# EasyEDA Pro project 空调控制板.epro

# Schematic 空调控制板
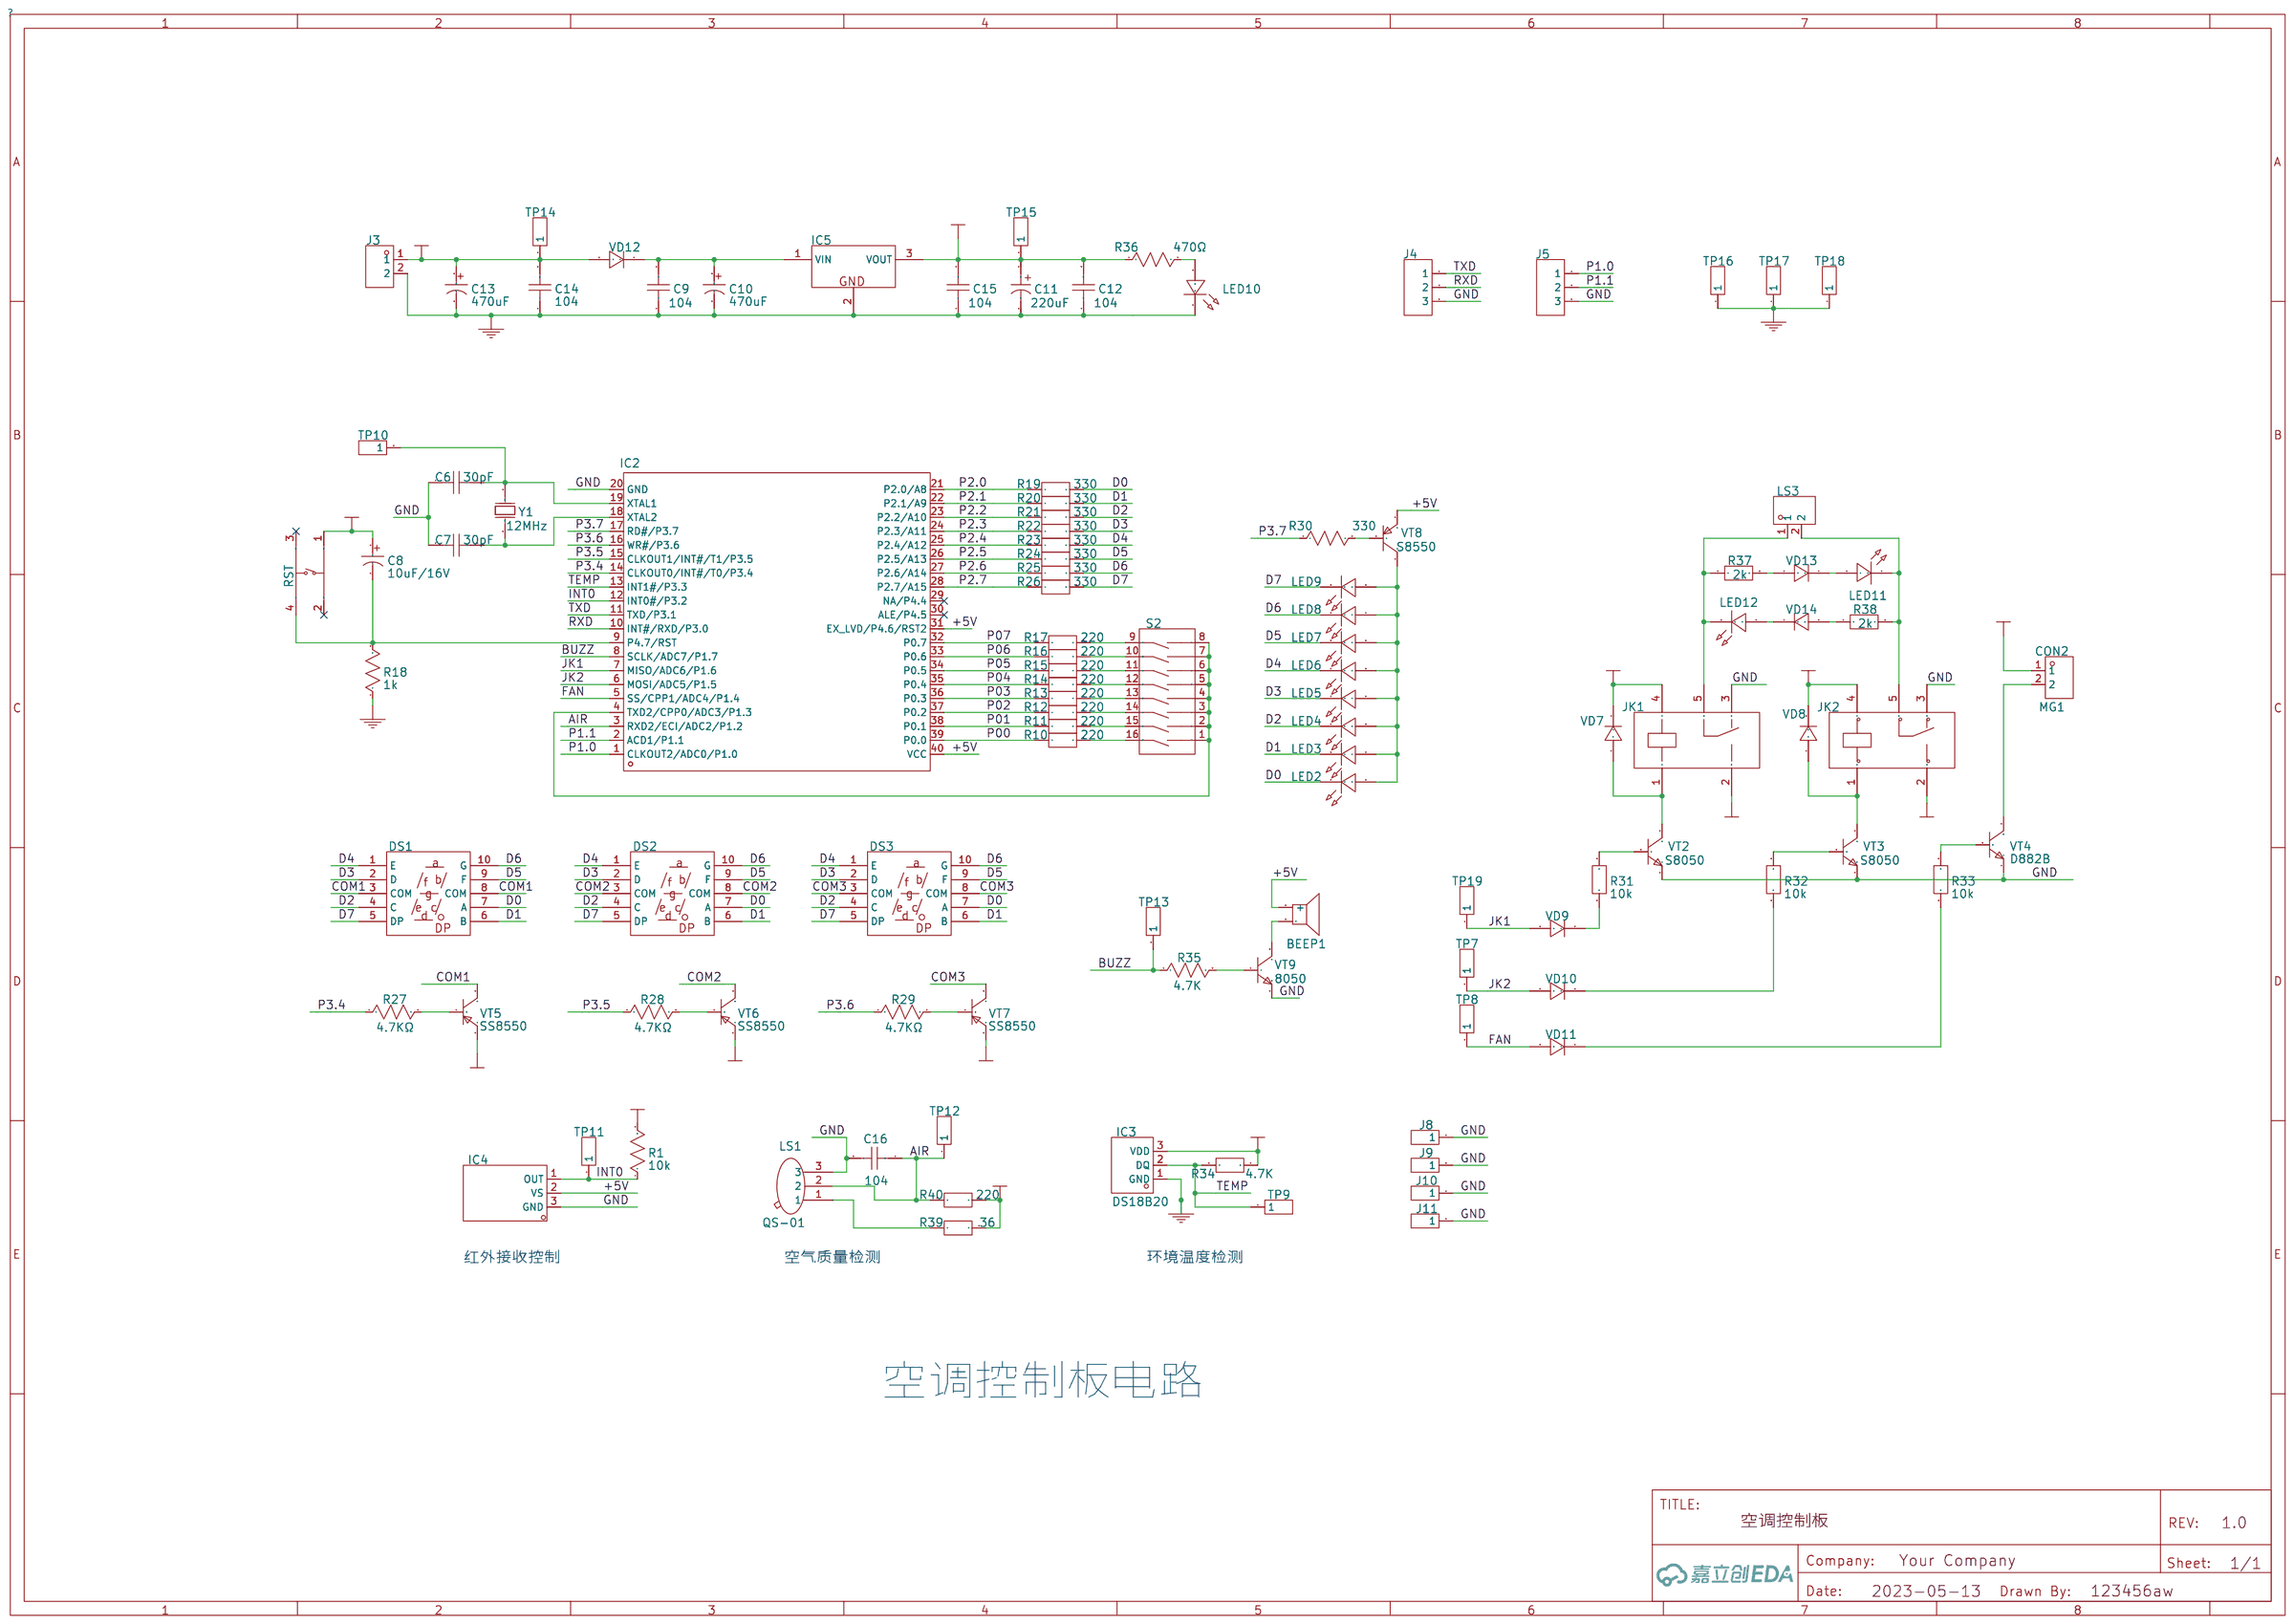
[diagram p0: schematic sheet]

## Parts
BEEP1  TMB12A05  [BUZ-TH_BD12.0-P7.60-D0.6-FD]
C6  30pF  [C0805]
C7  30pF  [C0805]
C8  10uF/16V  [CAP-TH_BD5.0-P2.5-D0.5-FD]
C9  104  [C0805]
C10  470uF  [CAP-TH_BD10.0-P5.00-D1.0-FD]
C11  220uF  [CAP-TH_BD8.0-P3.50-D0.6-FD_1]
C12  104  [C0805]
C13  470uF  [CAP-TH_BD10.0-P5.00-D1.0-FD]
C14  104  [C0805]
C15  104  [C0805]
C16  104  [C0805]
CON2  MG1  [CONN-TH_XY301V-A-5.0-2P]
DS1  FJ5101BH  [LED-SEG-TH_FJ5101BH]
DS2  FJ5101BH  [LED-SEG-TH_FJ5101BH]
DS3  FJ5101BH  [LED-SEG-TH_FJ5101BH]
IC2  STC12C5A32S2  [DIP-40_L52.3-W13.9-P2.54-LS15.2-BL]
IC3  DS18B20  [TO-92-3_L4.9-W3.7-P1.27-L]
IC4  TSOP31256  [红外接收管封装]
IC5  LM7805CT_C5444281  [三端稳压器LM7805]
J3  GND   +12V  [CONN-TH_XY301V-A-5.0-2P]
J4  TXD RXD GND  [HDR-F-2.54_1X3]
J5  HDR-F-2.54_1x3  [HDR-F-2.54_1X3]
J8  RS  [焊盘M3]
J9  RS  [焊盘M3]
J10  RS  [焊盘M3]
J11  RS  [焊盘M3]
JK1  SRD-12VDC-SL-C  [RELAY-TH_SRD-XXVDC-XL-C]
JK2  SRD-12VDC-SL-C  [RELAY-TH_SRD-XXVDC-XL-C]
LED2  LED-0805_R  [LED0805_RED]
LED3  LED-0805_R  [LED0805_RED]
LED4  LED-0805_R  [LED0805_RED]
LED5  LED-0805_R  [LED0805_RED]
LED6  LED-0805_R  [LED0805_RED]
LED7  LED-0805_R  [LED0805_RED]
LED8  LED-0805_R  [LED0805_RED]
LED9  LED-0805_R  [LED0805_RED]
LED10  LED-0805_R  [LED0805_RED]
LED11  LED-0805_R  [LED0805_RED]
LED12  LED-0805_R  [LED0805_RED]
LS1  QS-01  [空气质量传感器]
LS3  XY301V-A-5.0-2P  [CONN-TH_XY301V-A-5.0-2P]
R1  10k  [R0805]
R10  220  [R0805]
R11  220  [R0805]
R12  220  [R0805]
R13  220  [R0805]
R14  220  [R0805]
R15  220  [R0805]
R16  220  [R0805]
R17  220  [R0805]
R18  1k  [R0805]
R19  330  [R0805]
R20  330  [R0805]
R21  330  [R0805]
R22  330  [R0805]
R23  330  [R0805]
R24  330  [R0805]
R25  330  [R0805]
R26  330  [R0805]
R27  4.7KΩ  [R0805]
R28  4.7KΩ  [R0805]
R29  4.7KΩ  [R0805]
R30  330  [R0805]
R31  10k  [R0805]
R32  10k  [R0805]
R33  10k  [R0805]
R34  4.7K  [R0805]
R35  4.7K  [R0805]
R36  470Ω  [R0805]
R37  2k  [R0805]
R38  2k  [R0805]
R39  36  [R2010]
R40  220  [R0805]
RST  TS665CJ  [SW-TH_4P-L6.0-W6.0-P4.50-LS6.5]
S2  2.54插件8位拨码开关  [SW-TH_16P-L21.9-W9.9-P2.54-LS7.8]
TP7  HDR-M-2.54_1x1  [HDR-M-2.54_1X1]
TP8  HDR-M-2.54_1x1  [HDR-M-2.54_1X1]
TP9  HDR-M-2.54_1x1  [HDR-M-2.54_1X1]
TP10  HDR-M-2.54_1x1  [HDR-M-2.54_1X1]
TP11  HDR-M-2.54_1x1  [HDR-M-2.54_1X1]
TP12  HDR-M-2.54_1x1  [HDR-M-2.54_1X1]
TP13  HDR-M-2.54_1x1  [HDR-M-2.54_1X1]
TP14  HDR-M-2.54_1x1  [HDR-M-2.54_1X1]
TP15  HDR-M-2.54_1x1  [HDR-M-2.54_1X1]
TP16  HDR-M-2.54_1x1  [HDR-M-2.54_1X1]
TP17  HDR-M-2.54_1x1  [HDR-M-2.54_1X1]
TP18  HDR-M-2.54_1x1  [HDR-M-2.54_1X1]
TP19  HDR-M-2.54_1x1  [HDR-M-2.54_1X1]
VD7  1N4007G_C189227  [DO-41_BD2.4-L4.7-P8.70-D0.9-RD]
VD8  1N4007G_C189227  [DO-41_BD2.4-L4.7-P8.70-D0.9-RD]
VD9  1N4007G_C189227  [DO-41_BD2.4-L4.7-P8.70-D0.9-RD]
VD10  1N4007G_C189227  [DO-41_BD2.4-L4.7-P8.70-D0.9-RD]
VD11  1N4007G_C189227  [DO-41_BD2.4-L4.7-P8.70-D0.9-RD]
VD12  1N4007G_C189227  [DO-41_BD2.4-L4.7-P8.70-D0.9-RD]
VD13  1N4007G_C189227  [DO-41_BD2.4-L4.7-P8.70-D0.9-RD]
VD14  1N4007G_C189227  [DO-41_BD2.4-L4.7-P8.70-D0.9-RD]
VT2  S8050  [SOT-23-3_L2.9-W1.6-P1.90-LS2.8-BR]
VT3  S8050  [SOT-23-3_L2.9-W1.6-P1.90-LS2.8-BR]
VT4  D882B  [TO-126_L7.8-W2.7-P2.30-L]
VT5  SS8550  [SOT-23-3_L2.9-W1.3-P1.90-LS2.4-BR]
VT6  SS8550  [SOT-23-3_L2.9-W1.3-P1.90-LS2.4-BR]
VT7  SS8550  [SOT-23-3_L2.9-W1.3-P1.90-LS2.4-BR]
VT8  S8550  [SOT-23-3_L2.9-W1.6-P1.90-LS2.8-BR]
VT9  8050  [SOT-23-3_L2.9-W1.6-P1.90-LS2.8-BR]
Y1  12MHz  [HC-49US_L11.5-W4.5-P4.88]

## Library data of the parts
BEEP1 = TMB12A05: link: https://item.szlcsc.com/200842.html; 3DModel: BUZ-TH_D12.0-H9.5-P7.60; Supplier: LCSC; Manufacturer: 华能; Supplier Part: C96093; JLCPCB Part Class: Extended Part; Frequency: 2.3kHz
C6 C7 = 30pF: link: https://item.szlcsc.com/373011.html; 3DModel: C0805_L2.0-W1.3-H1.3
C8 = 10uF/16V: link: https://item.szlcsc.com/292492.html; 3DModel: CAP-TH_BD5.0-H7.5-P2.5; Supplier: LCSC; Supplier Part: C216288; Manufacturer: HUAWEI(华威集团); Manufacturer Part: RL1C100MC110A00CV0; JLCPCB Part Class: Extended Part
C9 C12 C14-C16 = 104: link: https://item.szlcsc.com/373011.html; 3DModel: C0805_L2.0-W1.3-H1.3
C10 C13 = 470uF: link: https://item.szlcsc.com/44833.html; 3DModel: CAP-TH_D10.0-H16.0-P5.00; Supplier: LCSC; Manufacturer: CX(承兴); Manufacturer Part: KM477M050G20RR0VH2FP0; Supplier Part: C34642; JLCPCB Part Class: Extended Part
C11 = 220uF: link: https://atta.szlcsc.com/upload/public/pdf/source/20180416/C191234_733C5C0149568155CE2C084CF497C985.pdf; Supplier: LCSC; Supplier Part: C9900021408; Manufacturer: null; Manufacturer Part: 220uF/35V; JLCPCB Part Class: Extended Part
CON2 = MG1: link: https://item.szlcsc.com/581014.html; Supplier: LCSC; Supplier Part: C557651; Manufacturer: XINLAIYA(新莱亚); Manufacturer Part: XY301V-A-5.0-2P; JLCPCB Part Class: Extended Part
DS1-DS3 = FJ5101BH: link: https://item.szlcsc.com/24195.html; 3DModel: LED-SEG-TH_10P-L12.6-W19.0-H8.0-P2.54-S15.24; Supplier: LCSC; Manufacturer: 志浩; Supplier Part: C23462; JLCPCB Part Class: Extended Part
IC2 = STC12C5A32S2: link: https://lcsc.com/product-detail/Others_STC11F56XE-35I-DIP40_C190522.html; Supplier Part: C66940; Supplier: LCSC; 3DModel: DIP-40_L52.3-W13.8-H4.0-LS15.24-P2.54; Manufacturer: STC(宏晶); Manufacturer Part: STC12C5A32S2-35I-PDIP40; JLCPCB Part Class: Extended Part
IC3 = DS18B20: link: https://atta.szlcsc.com/upload/public/pdf/source/20180629/C233232_99576441F8ED8E9074FB1575A6BE3592.PDF; Supplier: LCSC; Supplier Part: C376006; Manufacturer: UMW(广东友台半导体); JLCPCB Part Class: Extended Part
IC4 = TSOP31256: Supplier: LCSC; Supplier Part: C222500; Manufacturer: VISHAY(威世); JLCPCB Part Class: Extended Part
IC5 = LM7805CT_C5444281: link: https://atta.szlcsc.com/upload/public/pdf/source/20230412/F9CA8B8719EFD180D2AD5626231BCBB0.pdf; Supplier: LCSC; Supplier Part: C5444281; Manufacturer: Siproin(上海矽朋); Manufacturer Part: LM7805CT
J3 = GND   +12V: link: https://item.szlcsc.com/581014.html; Supplier: LCSC; Supplier Part: C557651; Manufacturer: XINLAIYA(新莱亚); Manufacturer Part: XY301V-A-5.0-2P; JLCPCB Part Class: Extended Part
J4 = TXD RXD GND: 3DModel: HDR-F-2.54_1x3; link: https://www.cjt.com/Upload/A2541.pdf; Supplier Part: C146690; Supplier: LCSC
J5 = HDR-F-2.54_1x3: link: https://www.cjt.com/Upload/A2541.pdf; Supplier Part: C146690; Supplier: LCSC
J8-J11 = RS: Supplier Part: C81276; Supplier: LCSC
JK1 JK2 = SRD-12VDC-SL-C: link: https://item.szlcsc.com/31188.html; 3DModel: RELAY-TH_L19.2-W15.6-H15.8; Supplier: LCSC; Manufacturer: 松乐; Supplier Part: C30431; JLCPCB Part Class: Extended Part
LED2-LED12 = LED-0805_R: 3DModel: LED0805_Red; Manufacturer: EVERLIGHT(台湾亿光); Manufacturer Part: 17-21SURC/S530-A3/TR8; Supplier Part: C72037
LS1 = QS-01: Supplier: LCSC; Supplier Part: C242507; Manufacturer: Winsen(炜盛); Manufacturer Part: MP901; JLCPCB Part Class: Extended Part
LS3 = XY301V-A-5.0-2P: link: https://item.szlcsc.com/581014.html; Supplier: LCSC; Supplier Part: C557651; Manufacturer: XINLAIYA(新莱亚); JLCPCB Part Class: Extended Part
R1 R31-R33 = 10k: link: https://item.szlcsc.com/142685.html; 3DModel: R0805_L2.0-W1.3-H0.6
R10-R17 R40 = 220: link: https://item.szlcsc.com/142685.html; 3DModel: R0805_L2.0-W1.3-H0.6
R18 = 1k: link: https://item.szlcsc.com/142685.html; 3DModel: R0805_L2.0-W1.3-H0.6
R19-R26 R30 = 330: link: https://item.szlcsc.com/142685.html; 3DModel: R0805_L2.0-W1.3-H0.6
R27-R29 = 4.7KΩ: link: https://item.szlcsc.com/142685.html; 3DModel: R0805_L2.0-W1.3-H0.6
R34 R35 = 4.7K: link: https://item.szlcsc.com/142685.html; 3DModel: R0805_L2.0-W1.3-H0.6
R36 = 470Ω: link: https://item.szlcsc.com/142685.html; 3DModel: R0805_L2.0-W1.3-H0.6
R37 R38 = 2k: link: https://item.szlcsc.com/142685.html; 3DModel: R0805_L2.0-W1.3-H0.6
R39 = 36: link: https://item.szlcsc.com/312125.html; 3DModel: R2010_L5.0-W2.5-H0.6; Supplier: LCSC; Supplier Part: C407043; Manufacturer: UNI-ROYAL(厚声); Manufacturer Part: 201007F360JT4E; JLCPCB Part Class: Extended Part
RST = TS665CJ: link: https://item.szlcsc.com/14483.html; 3DModel: SW-TH_4P-L6.0-W6.0-H5.0-LS6.5-P4.50; Supplier: LCSC; Supplier Part: C393938; Manufacturer: SHOU HAN(首韩); JLCPCB Part Class: Extended Part
S2 = 2.54插件8位拨码开关: link: https://img.jlc.com/image//data/smt-stock-produce/componentSizePhoto/2022-01-10/20de4d79767c4f13a7ca3c4356335101/BG2201070020_D21122300030_font.png; Supplier: LCSC; Supplier Part: C9900005795; Manufacturer: null; JLCPCB Part Class: Extended Part
TP7-TP19 = HDR-M-2.54_1x1: Supplier Part: C81276; Supplier: LCSC
VD7-VD14 = 1N4007G_C189227: link: https://item.szlcsc.com/85412.html; 3DModel: DO-41_D2.4-L4.7-P8.70; Supplier: LCSC; Supplier Part: C189227; Manufacturer: 迪一; Manufacturer Part: 1N4007G; JLCPCB Part Class: Extended Part
VT2 VT3 = S8050: link: https://item.szlcsc.com/14454.html; 3DModel: SOT-23-3L_L2.9-W1.6-H1.1-LS2.8-P0.95; Supplier: LCSC; Manufacturer: Hottech(合科泰); Supplier Part: C181158; JLCPCB Part Class: Extended Part
VT4 = D882B: link: https://item.szlcsc.com/156484.html; Supplier: LCSC; Supplier Part: C438615; Manufacturer: FeiHong(飞虹); JLCPCB Part Class: Extended Part
VT5-VT7 = SS8550: link: https://atta.szlcsc.comnull; 3DModel: SOT-23-3P_L2.9-W1.3-H1.0-LS2.4-P0.95; Supplier: LCSC; Supplier Part: C5120747; Manufacturer: MSKSEMI(美森科); Manufacturer Part: SS8550-MS; JLCPCB Part Class: Extended Part
VT8 = S8550: link: https://item.szlcsc.com/14454.html; 3DModel: SOT-23-3L_L2.9-W1.6-H1.1-LS2.8-P0.95; Supplier: LCSC; Manufacturer: CJ(江苏长电/长晶); Supplier Part: C105432; JLCPCB Part Class: Basic Part
VT9 = 8050: link: https://item.szlcsc.com/14454.html; 3DModel: SOT-23-3L_L2.9-W1.6-H1.1-LS2.8-P0.95; Supplier: LCSC; Manufacturer: CJ(江苏长电/长晶); Manufacturer Part: S9013; Supplier Part: C107404; JLCPCB Part Class: Extended Part
Y1 = 12MHz: link: https://lcsc.com/product-detail/DIP-Crystal-Resonators_Made-in-China-Made-in-China-37-5Mhz-20PF-20PPM_C52062.html; 3DModel: HC-49US_L11.0-W4.5-H3.5-P4.88; Supplier: LCSC; Manufacturer: YXC(扬兴晶振); Manufacturer Part: X49SD12MSD2SC; Supplier Part: C16369; JLCPCB Part Class: Extended Part

## Nets
+5V: BEEP1.1(+) C8.1 C11.1 C12.2 C15.2 IC2.31(EX_LVD/P4.6/RST2) IC2.40(VCC) IC3.3(VDD) IC4.2(VS) IC5.3(VOUT) R1.2 R34.1 R36.1 R39.2 R40.2 RST.1(A) TP15.1 VT5.2(E) VT6.2(E) VT7.2(E) VT8.2
+12V: C13.1 C14.2 CON2.1 J3.1 JK1.2 JK1.4 JK2.2 JK2.4 TP14.1 VD7.1 VD8.1 VD12.2
GND: C6.1 C7.1 C9.1 C10.2 C11.2 C12.1 C13.2 C14.1 C15.1 C16.2 IC2.20(GND) IC3.1(GND) IC4.3(GND) IC5.2(GND) J3.2 J4.3 J5.3 J8.1 J9.1 J10.1 J11.1 JK1.3 JK2.3 LED10.2 LS1.3 R18.1 TP16.1 TP17.1 TP18.1 VT2.2 VT3.2 VT4.1(E) VT9.2
AIR: C16.1 IC2.3(RXD2/ECI/ADC2/P1.2) LS1.2 R40.1 TP12.1
BUZZ: IC2.8(SCLK/ADC7/P1.7) R35.1 TP13.1
COM1: DS1.3(COM) DS1.8(COM) VT5.3(C)
COM2: DS2.3(COM) DS2.8(COM) VT6.3(C)
COM3: DS3.3(COM) DS3.8(COM) VT7.3(C)
D0: DS1.7(A) DS2.7(A) DS3.7(A) LED2.2 R19.2
D1: DS1.6(B) DS2.6(B) DS3.6(B) LED3.2 R20.2
D2: DS1.4(C) DS2.4(C) DS3.4(C) LED4.2 R21.2
D3: DS1.2(D) DS2.2(D) DS3.2(D) LED5.2 R22.2
D4: DS1.1(E) DS2.1(E) DS3.1(E) LED6.2 R23.2
D5: DS1.9(F) DS2.9(F) DS3.9(F) LED7.2 R24.2
D6: DS1.10(G) DS2.10(G) DS3.10(G) LED8.2 R25.2
D7: DS1.5(DP) DS2.5(DP) DS3.5(DP) LED9.2 R26.2
FAN: IC2.5(SS/CPP1/ADC4/P1.4) TP8.1 VD11.2
INT0: IC2.12(INT0#/P3.2) IC4.1(OUT) R1.1 TP11.1
JK1: IC2.7(MISO/ADC6/P1.6) TP19.1 VD9.2
JK2: IC2.6(MOSI/ADC5/P1.5) TP7.1 VD10.2
P00: IC2.39(P0.0) R10.1
P01: IC2.38(P0.1) R11.1
P1.0: IC2.1(CLKOUT2/ADC0/P1.0) J5.1
P1.1: IC2.2(ACD1/P1.1) J5.2
P02: IC2.37(P0.2) R12.1
P2.0: IC2.21(P2.0/A8) R19.1
P2.1: IC2.22(P2.1/A9) R20.1
P2.2: IC2.23(P2.2/A10) R21.1
P2.3: IC2.24(P2.3/A11) R22.1
P2.4: IC2.25(P2.4/A12) R23.1
P2.5: IC2.26(P2.5/A13) R24.1
P2.6: IC2.27(P2.6/A14) R25.1
P2.7: IC2.28(P2.7/A15) R26.1
P03: IC2.36(P0.3) R13.1
P3.4: IC2.14(CLKOUT0/INT#/T0/P3.4) R27.1
P3.5: IC2.15(CLKOUT1/INT#/T1/P3.5) R28.1
P3.6: IC2.16(WR#/P3.6) R29.1
P3.7: IC2.17(RD#/P3.7) R30.1
P04: IC2.35(P0.4) R14.1
P05: IC2.34(P0.5) R15.1
P06: IC2.33(P0.6) R16.1
P07: IC2.32(P0.7) R17.1
RXD: IC2.10(INT#/RXD/P3.0) J4.2
TEMP: IC2.13(INT1#/P3.3) IC3.2(DQ) R34.2 TP9.1
TXD: IC2.11(TXD/P3.1) J4.1
BEEP1_2: BEEP1.2 VT9.3
C7_2: C7.2 IC2.18(XTAL2) Y1.2(OSC2)
CON2_2: CON2.2 VT4.2(C)
IC2_4: IC2.4(TXD2/CPP0/ADC3/P1.3) S2.1 S2.2 S2.3 S2.4 S2.5 S2.6 S2.7 S2.8
IC5_1: C9.2 C10.1 IC5.1(VIN) VD12.1
JK2_1: JK2.1 VD8.2 VT3.3
LED10_1: LED10.1 R36.2
LED12_1: LED12.1 VD14.1
LS1_1: LS1.1 R39.1
LS3_1: JK1.5 LED12.2 LS3.1 R37.1
LS3_2: JK2.5 LED11.2 LS3.2 R38.2
R10_2: R10.2 S2.16
R11_2: R11.2 S2.15
R12_2: R12.2 S2.14
R13_2: R13.2 S2.13
R14_2: R14.2 S2.12
R15_2: R15.2 S2.11
R16_2: R16.2 S2.10
R17_2: R17.2 S2.9
R18_2: C8.2 IC2.9(P4.7/RST) R18.2 RST.4(D)
R29_2: R29.2 VT7.1(B)
R30_2: R30.2 VT8.1
R33_2: R33.2 VT4.3(B)
R37_2: R37.2 VD13.2
TP10_1: C6.2 IC2.19(XTAL1) TP10.1 Y1.1(OSC1)
VD7_2: JK1.1 VD7.2 VT2.3
VD9_1: R31.1 VD9.1
VD10_1: R32.1 VD10.1
VD11_1: R33.1 VD11.1
VD13_1: LED11.1 VD13.1
VD14_2: R38.1 VD14.2
VT2_1: R31.2 VT2.1
VT3_1: R32.2 VT3.1
VT5_1: R27.2 VT5.1(B)
VT6_1: R28.2 VT6.1(B)
VT8_3: LED2.1 LED3.1 LED4.1 LED5.1 LED6.1 LED7.1 LED8.1 LED9.1 VT8.3
VT9_1: R35.2 VT9.1

Not connected (* = marked no-connect by the designer): IC2 29(NA/P4.4)* 30(ALE/P4.5)*; RST 2(B)* 3(C)*

## Notes on the sheet
- 红外接收控制
- 空气质量检测
- 环境温度检测
- 空调控制板电路

# Board 1-PCB_PCB_空调控制板
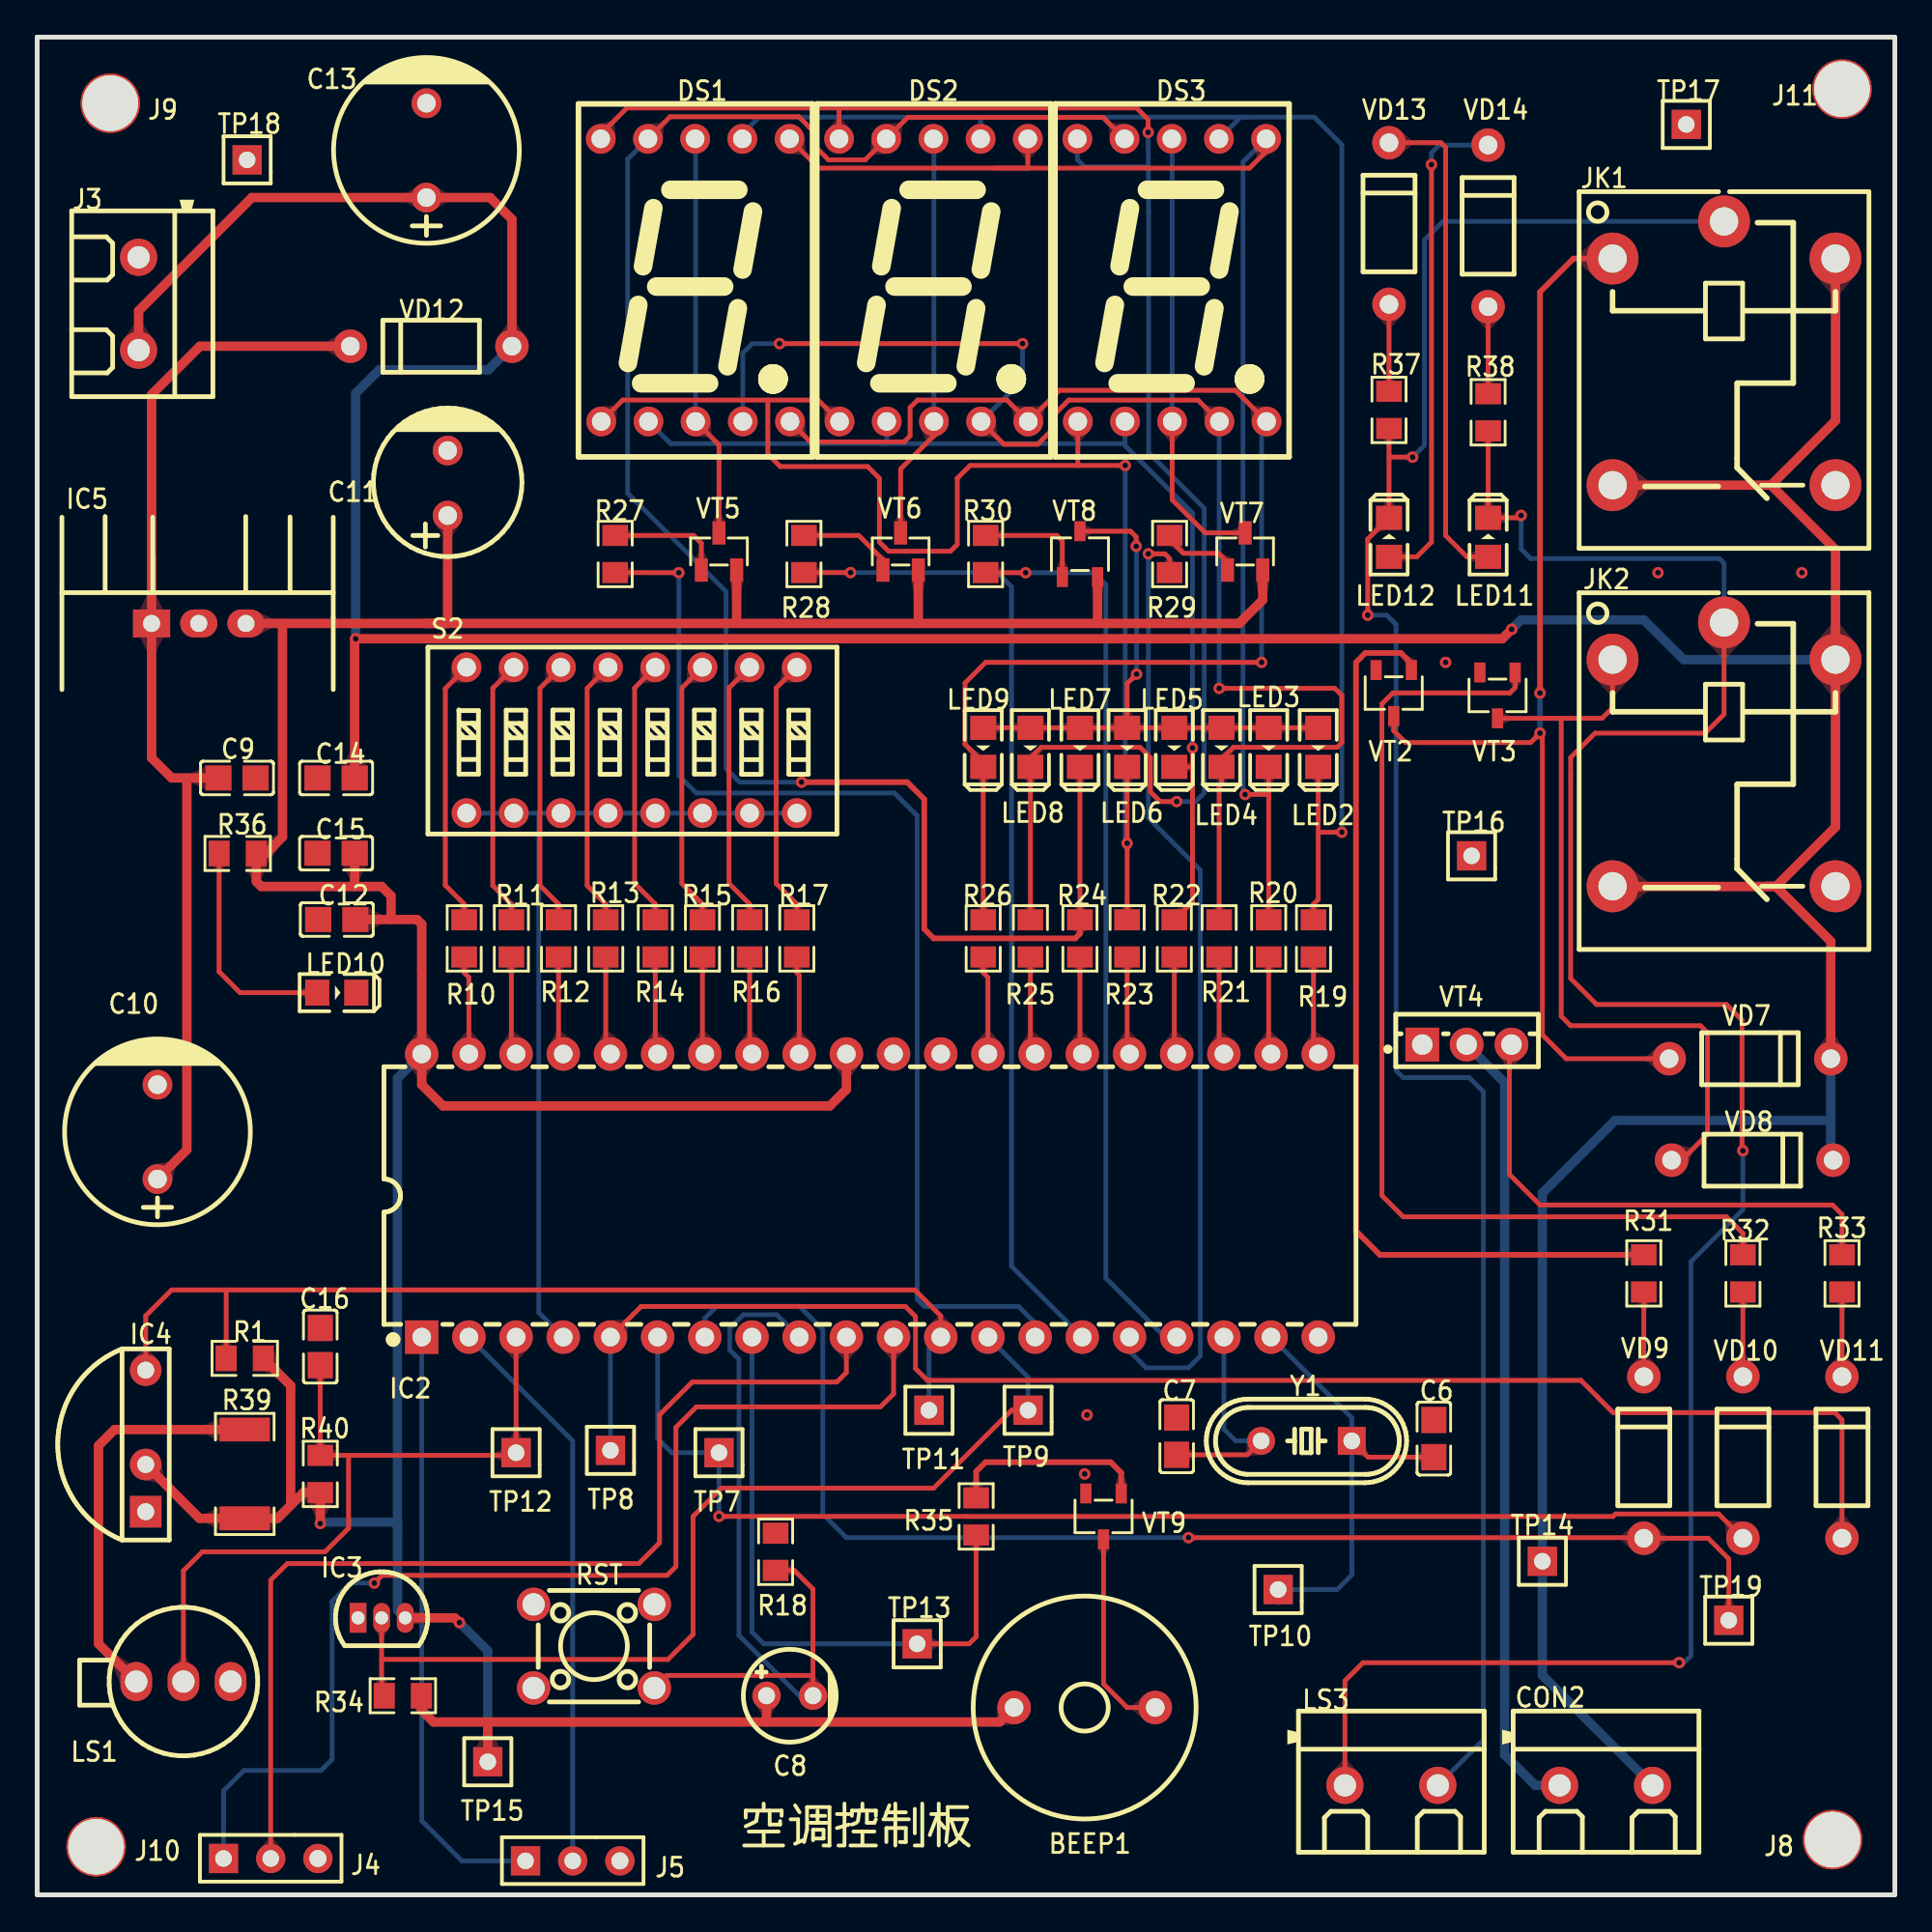
[diagram p1: board, top side]
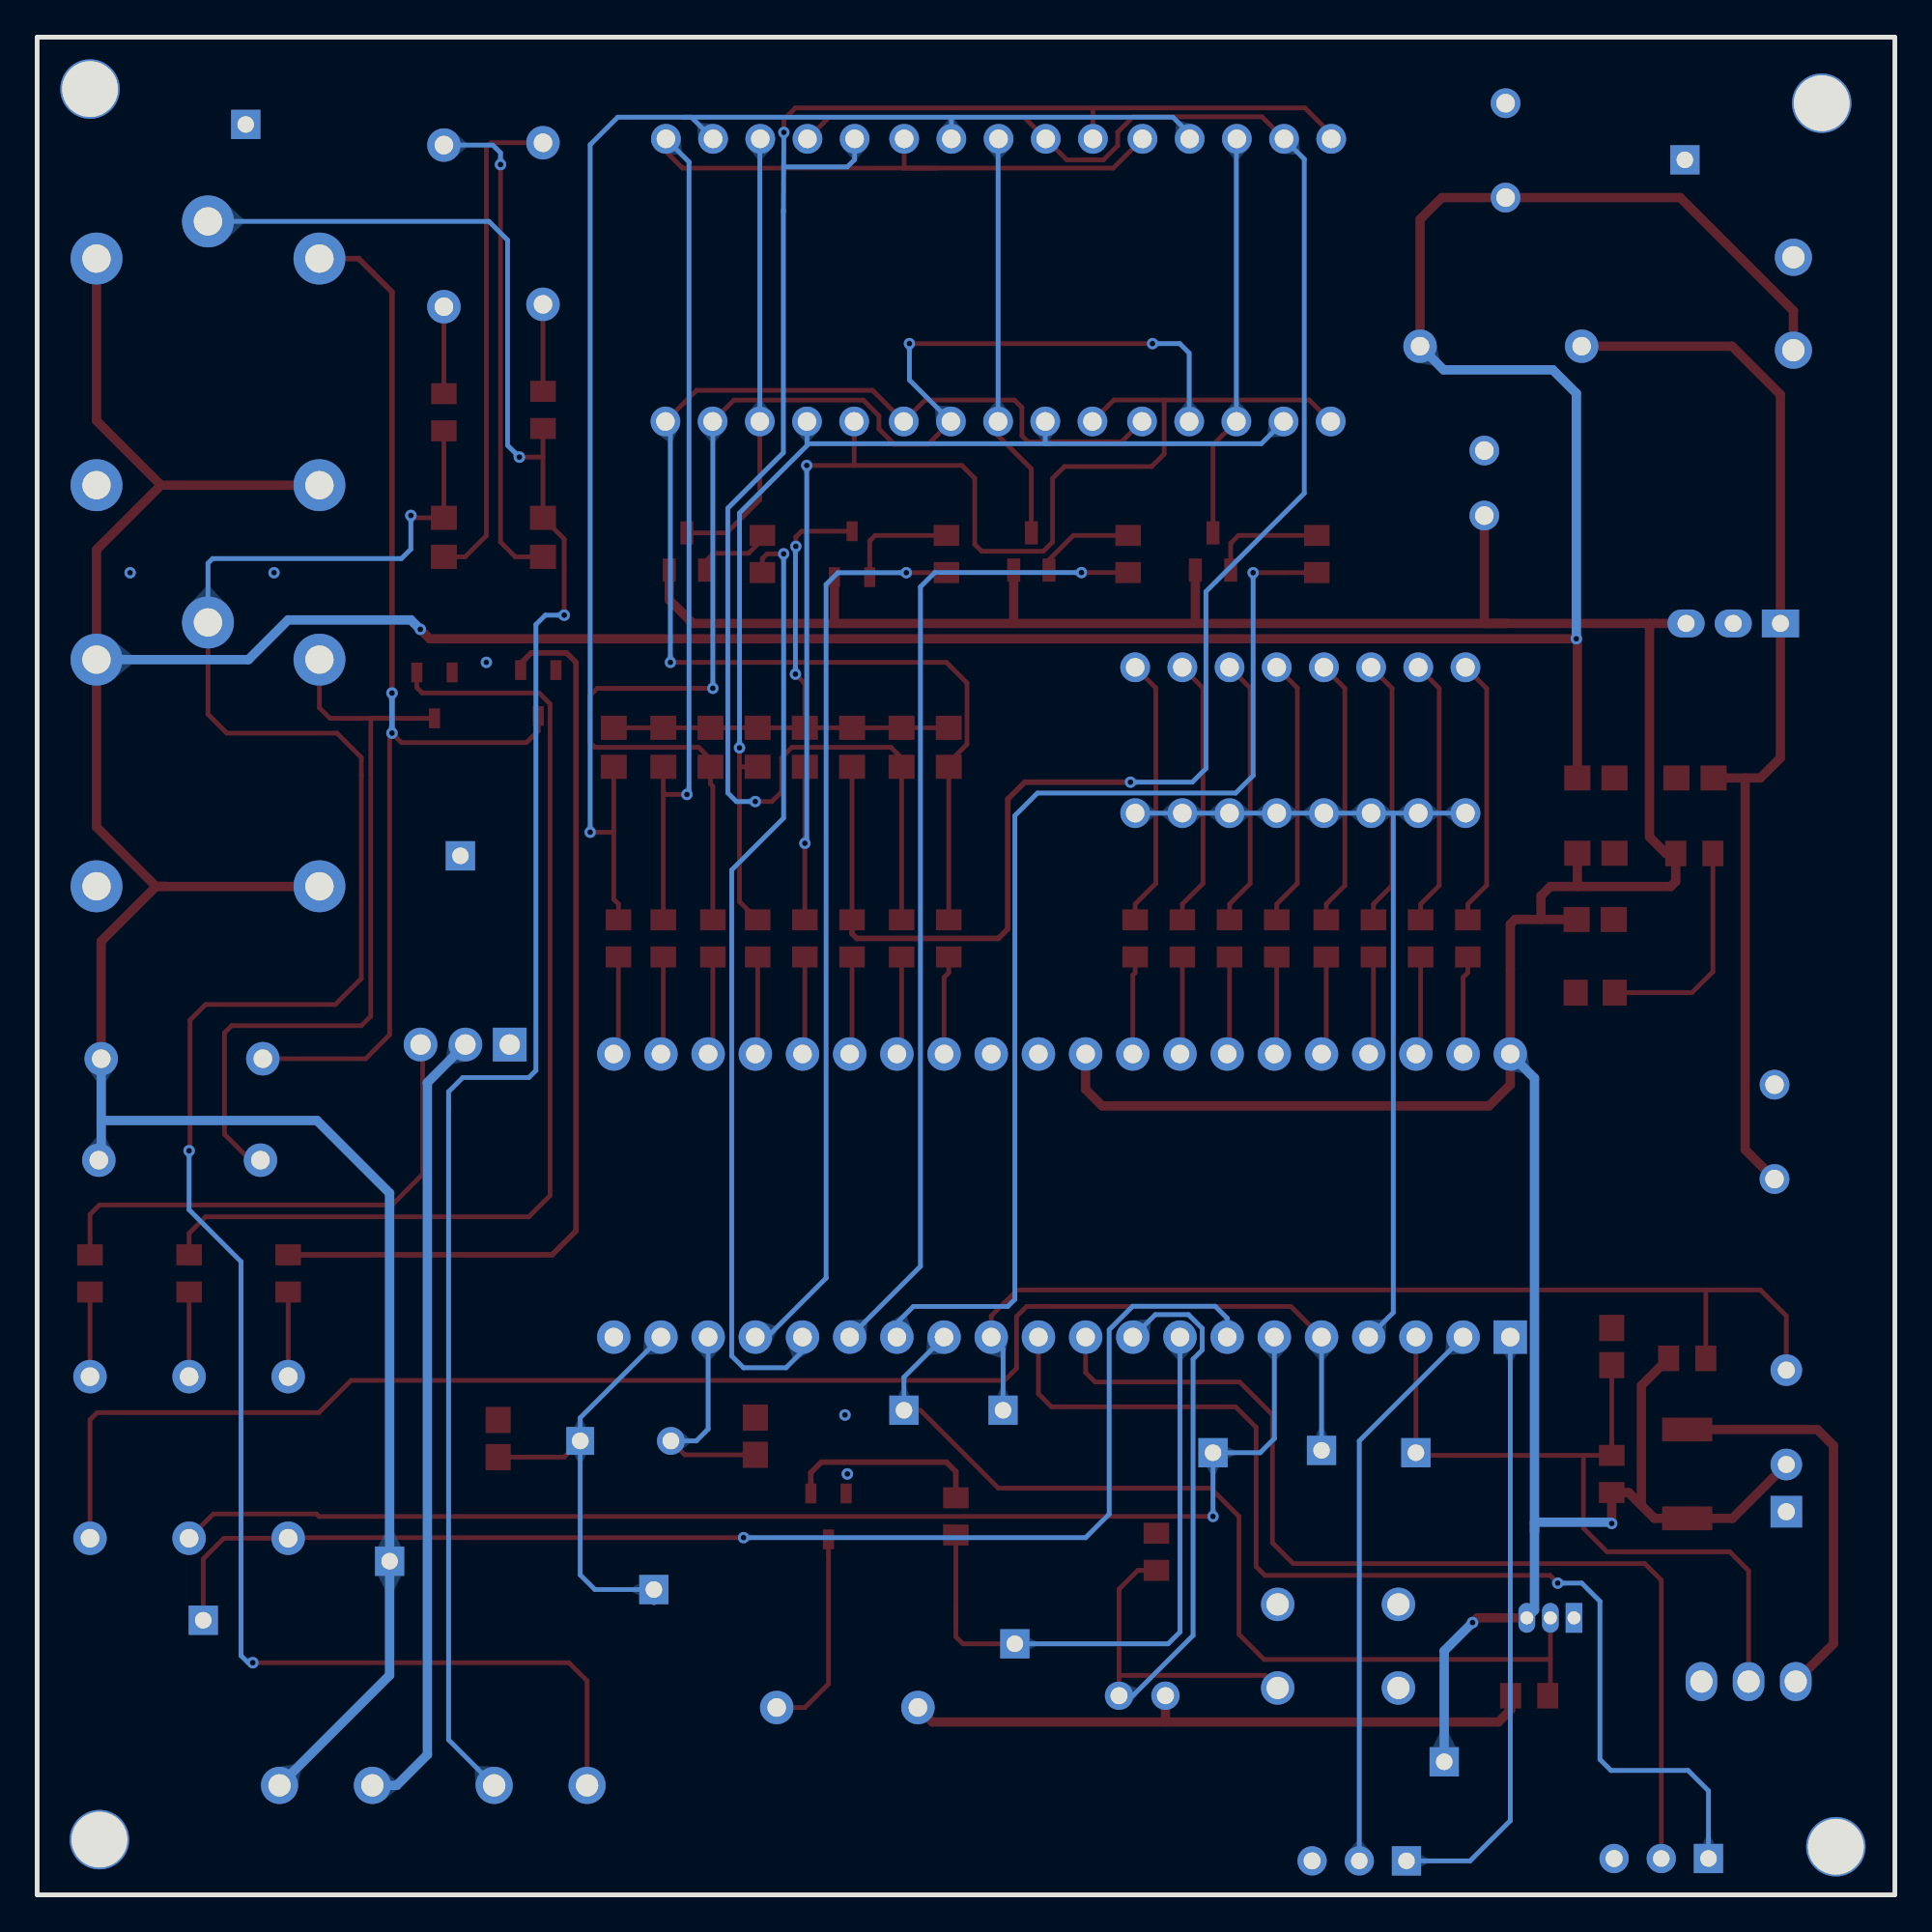
[diagram p2: board, bottom side, seen from below]

Outline 100 x 100 mm; copper layers: Top Layer, Bottom Layer. Coordinates in mm from the lower left corner of the outline.
Outline path: 0,100 100,100 100,0 0,0 0,100
Stack: Top Layer 0.035mm / Dielectric1 1.51mm FR4 er 4.5 / Bottom Layer 0.035mm

## Design rules (mm)
spacing Default (default): track to track 0.152, other pairs 0 to 0.152
spacing +5V: track to track 0.152, other pairs 0 to 0.152
spacing +12V: track to track 0.152, other pairs 0 to 0.152
track width Default (default): min 0.254, default 0.254, max 25.4
track width +5V: min 0.5, default 0.5, max 25.4
track width +12V: min 0.5, default 0.5, max 25.4
differential pair differentialPair (default): width min 0.127, default 0.254, max 2.54; gap min 0.152, default 0.152
via Default (default): diameter min 0.61, default 0.61, max 100.025; hole min 0.305, default 0.305, max 59.995
via +5V: diameter min 0.61, default 0.61, max 100.025; hole min 0.305, default 0.305, max 59.995
via +12V: diameter min 0.61, default 0.61, max 100.025; hole min 0.305, default 0.305, max 59.995
net +5V uses +5V
net +12V uses +12V
net GND uses gge93414
pour e190 uses gge93423
pour e770 uses gge93414

## Placement (name value [footprint] x y rotation side)
BEEP1  TMB12A05  [BUZ-TH_BD12.0-P7.60-D0.6-FD]  56.39 10.08 0 top
C6  30pF  [C0805]  75.18 24.56 270 top
C7  30pF  [C0805]  61.34 24.69 270 top
C8  10uF/16V  [CAP-TH_BD5.0-P2.5-D0.5-FD]  40.51 10.72 0 top
C9  104  [C0805]  10.76 60.12 180 top
C10  470uF  [CAP-TH_BD10.0-P5.00-D1.0-FD]  6.48 41.07 90 top
C11  220uF  [CAP-TH_BD8.0-P3.50-D0.6-FD_1]  22.1 76 90 top
C12  104  [C0805]  16.13 52.5 0 top
C13  470uF  [CAP-TH_BD10.0-P5.00-D1.0-FD]  20.95 93.9 90 top
C14  104  [C0805]  16.09 60.12 0 top
C15  104  [C0805]  16.09 56.07 0 top
C16  104  [C0805]  15.24 29.51 90 top
CON2  MG1  [CONN-TH_XY301V-A-5.0-2P]  84.46 5.89 180 top
DS1  FJ5101BH  [LED-SEG-TH_FJ5101BH]  35.43 86.92 0 top
DS2  FJ5101BH  [LED-SEG-TH_FJ5101BH]  48.26 86.92 0 top
DS3  FJ5101BH  [LED-SEG-TH_FJ5101BH]  61.09 86.92 0 top
IC2  STC12C5A32S2  [DIP-40_L52.3-W13.9-P2.54-LS15.2-BL]  44.83 37.64 0 top
IC3  DS18B20  [TO-92-3_L4.9-W3.7-P1.27-L]  18.54 14.91 0 top
IC4  TSOP31256  [红外接收管封装]  5.84 23.16 0 top
IC5  LM7805CT_C5444281  [三端稳压器LM7805]  8.64 69.52 0 top
J3  GND   +12V  [CONN-TH_XY301V-A-5.0-2P]  5.46 85.65 90 top
J4  TXD RXD GND  [HDR-F-2.54_1X3]  12.57 1.96 0 top
J5  HDR-F-2.54_1x3  [HDR-F-2.54_1X3]  28.83 1.83 0 top
J8  RS  [焊盘M3]  96.39 3.1 0 top
J9  RS  [焊盘M3]  3.68 96.57 0 top
J10  RS  [焊盘M3]  2.92 2.72 0 top
J11  RS  [焊盘M3]  96.9 97.33 0 top
JK1  SRD-12VDC-SL-C  [RELAY-TH_SRD-XXVDC-XL-C]  90.81 82.98 270 top
JK2  SRD-12VDC-SL-C  [RELAY-TH_SRD-XXVDC-XL-C]  90.81 61.39 270 top
LED2  LED-0805_R  [LED0805_RED]  68.96 61.77 270 top
LED3  LED-0805_R  [LED0805_RED]  66.29 61.77 270 top
LED4  LED-0805_R  [LED0805_RED]  63.75 61.77 270 top
LED5  LED-0805_R  [LED0805_RED]  61.21 61.77 270 top
LED6  LED-0805_R  [LED0805_RED]  58.67 61.77 270 top
LED7  LED-0805_R  [LED0805_RED]  56.13 61.77 270 top
LED8  LED-0805_R  [LED0805_RED]  53.47 61.77 270 top
LED9  LED-0805_R  [LED0805_RED]  50.93 61.77 270 top
LED10  LED-0805_R  [LED0805_RED]  16.13 48.56 0 top
LED11  LED-0805_R  [LED0805_RED]  78.1 73.08 90 top
LED12  LED-0805_R  [LED0805_RED]  72.77 73.08 90 top
LS1  QS-01  [空气质量传感器]  7.87 11.48 0 top
LS3  XY301V-A-5.0-2P  [CONN-TH_XY301V-A-5.0-2P]  72.9 5.89 180 top
R1  10k  [R0805]  11.18 28.88 0 top
R10  220  [R0805]  22.99 51.49 90 top
R11  220  [R0805]  25.53 51.49 90 top
R12  220  [R0805]  28.07 51.49 90 top
R13  220  [R0805]  30.61 51.49 90 top
R14  220  [R0805]  33.27 51.49 90 top
R15  220  [R0805]  35.81 51.49 90 top
R16  220  [R0805]  38.35 51.49 90 top
R17  220  [R0805]  40.89 51.49 90 top
R18  1k  [R0805]  39.75 18.47 270 top
R19  330  [R0805]  68.71 51.49 90 top
R20  330  [R0805]  66.29 51.49 90 top
R21  330  [R0805]  63.63 51.49 90 top
R22  330  [R0805]  61.21 51.49 90 top
R23  330  [R0805]  58.67 51.49 90 top
R24  330  [R0805]  56.13 51.49 90 top
R25  330  [R0805]  53.47 51.49 90 top
R26  330  [R0805]  50.93 51.49 90 top
R27  4.7KΩ  [R0805]  31.12 72.18 90 top
R28  4.7KΩ  [R0805]  41.28 72.18 90 top
R29  4.7KΩ  [R0805]  60.96 72.18 90 top
R30  330  [R0805]  51.05 72.18 90 top
R31  10k  [R0805]  86.49 33.45 90 top
R32  10k  [R0805]  91.82 33.45 90 top
R33  10k  [R0805]  97.16 33.45 90 top
R34  4.7K  [R0805]  19.69 10.72 180 top
R35  4.7K  [R0805]  50.55 20.37 90 top
R36  470Ω  [R0805]  10.8 56.06 180 top
R37  2k  [R0805]  72.77 79.93 90 top
R38  2k  [R0805]  78.1 79.81 270 top
R39  36  [R2010]  11.18 22.66 270 top
R40  220  [R0805]  15.24 22.66 270 top
RST  TS665CJ  [SW-TH_4P-L6.0-W6.0-P4.50-LS6.5]  29.97 13.39 0 top
S2  2.54插件8位拨码开关  [SW-TH_16P-L21.9-W9.9-P2.54-LS7.8]  32 62.15 0 top
TP7  HDR-M-2.54_1x1  [HDR-M-2.54_1X1]  36.7 23.8 0 top
TP8  HDR-M-2.54_1x1  [HDR-M-2.54_1X1]  30.86 23.93 0 top
TP9  HDR-M-2.54_1x1  [HDR-M-2.54_1X1]  53.34 26.09 0 top
TP10  HDR-M-2.54_1x1  [HDR-M-2.54_1X1]  66.8 16.43 0 top
TP11  HDR-M-2.54_1x1  [HDR-M-2.54_1X1]  48.01 26.09 0 top
TP12  HDR-M-2.54_1x1  [HDR-M-2.54_1X1]  25.78 23.8 0 top
TP13  HDR-M-2.54_1x1  [HDR-M-2.54_1X1]  47.37 13.51 0 top
TP14  HDR-M-2.54_1x1  [HDR-M-2.54_1X1]  81.03 17.96 0 top
TP15  HDR-M-2.54_1x1  [HDR-M-2.54_1X1]  24.26 7.16 0 top
TP16  HDR-M-2.54_1x1  [HDR-M-2.54_1X1]  77.22 55.93 0 top
TP17  HDR-M-2.54_1x1  [HDR-M-2.54_1X1]  88.77 95.3 0 top
TP18  HDR-M-2.54_1x1  [HDR-M-2.54_1X1]  11.3 93.4 0 top
TP19  HDR-M-2.54_1x1  [HDR-M-2.54_1X1]  91.06 14.78 0 top
VD7  1N4007G_C189227  [DO-41_BD2.4-L4.7-P8.70-D0.9-RD]  92.2 45.01 180 top
VD8  1N4007G_C189227  [DO-41_BD2.4-L4.7-P8.70-D0.9-RD]  92.33 39.55 180 top
VD9  1N4007G_C189227  [DO-41_BD2.4-L4.7-P8.70-D0.9-RD]  86.49 23.55 270 top
VD10  1N4007G_C189227  [DO-41_BD2.4-L4.7-P8.70-D0.9-RD]  91.82 23.55 270 top
VD11  1N4007G_C189227  [DO-41_BD2.4-L4.7-P8.70-D0.9-RD]  97.16 23.55 270 top
VD12  1N4007G_C189227  [DO-41_BD2.4-L4.7-P8.70-D0.9-RD]  21.21 83.36 0 top
VD13  1N4007G_C189227  [DO-41_BD2.4-L4.7-P8.70-D0.9-RD]  72.77 89.97 270 top
VD14  1N4007G_C189227  [DO-41_BD2.4-L4.7-P8.70-D0.9-RD]  78.1 89.84 270 top
VT2  S8050  [SOT-23-3_L2.9-W1.6-P1.90-LS2.8-BR]  73.03 64.69 90 top
VT3  S8050  [SOT-23-3_L2.9-W1.6-P1.90-LS2.8-BR]  78.61 64.57 90 top
VT4  D882B  [TO-126_L7.8-W2.7-P2.30-L]  76.96 45.77 0 top
VT5  SS8550  [SOT-23-3_L2.9-W1.3-P1.90-LS2.4-BR]  36.7 72.31 270 top
VT6  SS8550  [SOT-23-3_L2.9-W1.3-P1.90-LS2.4-BR]  46.48 72.31 270 top
VT7  SS8550  [SOT-23-3_L2.9-W1.3-P1.90-LS2.4-BR]  65.02 72.31 270 top
VT8  S8550  [SOT-23-3_L2.9-W1.6-P1.90-LS2.8-BR]  56.13 72.17 270 top
VT9  8050  [SOT-23-3_L2.9-W1.6-P1.90-LS2.8-BR]  57.4 20.37 90 top
Y1  12MHz  [HC-49US_L11.5-W4.5-P4.88]  68.33 24.44 180 top

## Footprints (pads in the part's own frame, mm; a bottom-side part is the same pattern mirrored in y, then rotated)
BUZ-TH_BD12.0-P7.60-D0.6-FD
  round 1.8 hole 1: 1(-3.8,0) 2(3.8,0)
C0805
  rect 1.41x1.35 smd: 1(-1,0) 2(1,0)
CAP-TH_BD5.0-P2.5-D0.5-FD
  round 1.524 hole 0.914: 1(-1.25,0) 2(1.25,0)
CAP-TH_BD8.0-P3.50-D0.6-FD_1
  round 1.6 hole 1: 1(-1.75,0) 2(1.75,0)
CAP-TH_BD10.0-P5.00-D1.0-FD
  round 1.6 hole 1: 1(-2.54,0) 2(2.54,0)
CONN-TH_XY301V-A-5.0-2P
  round 2 hole 1.2: 1(-2.5,0) 2(2.5,0)
DIP-40_L52.3-W13.9-P2.54-LS15.2-BL
  rect 1.8x1.8 hole 1: 1(-24.13,-7.62)
  round 1.8 hole 1: 2(-21.59,-7.62) 3(-19.05,-7.62) 4(-16.51,-7.62) 5(-13.97,-7.62) 6(-11.43,-7.62) 7(-8.89,-7.62) 8(-6.35,-7.62) 9(-3.81,-7.62) 10(-1.27,-7.62) 11(1.27,-7.62) 12(3.81,-7.62) 13(6.35,-7.62) 14(8.89,-7.62) 15(11.43,-7.62) 16(13.97,-7.62) 17(16.51,-7.62) 18(19.05,-7.62) 19(21.59,-7.62) 20(24.13,-7.62) 21(24.13,7.62) 22(21.59,7.62) 23(19.05,7.62) 24(16.51,7.62) 25(13.97,7.62) 26(11.43,7.62) 27(8.89,7.62) 28(6.35,7.62) 29(3.81,7.62) 30(1.27,7.62) 31(-1.27,7.62) 32(-3.81,7.62) 33(-6.35,7.62) 34(-8.89,7.62) 35(-11.43,7.62) 36(-13.97,7.62) 37(-16.51,7.62) 38(-19.05,7.62) 39(-21.59,7.62) 40(-24.13,7.62)
DO-41_BD2.4-L4.7-P8.70-D0.9-RD
  round 1.8 hole 1: 1(-4.35,0) 2(4.35,0)
HC-49US_L11.5-W4.5-P4.88
  rect 1.5x1.5 hole 0.9: 1(-2.44,0)
  round 1.5 hole 0.9: 2(2.44,0)
HDR-F-2.54_1X3
  rect 1.575x1.575 hole 0.889: 1(-2.54,0)
  round 1.575 hole 0.889: 2(0,0)
  round 1.575 hole 0.914: 3(2.54,0)
HDR-M-2.54_1X1
  rect 1.575x1.575 hole 0.889: 1(0,0)
LED0805_RED
  rect 1.3x1.399 smd: 1(-1.05,0) 2(1.05,0)
LED-SEG-TH_FJ5101BH
  round 1.6 hole 1: 1(-5.067,-7.607) 2(-2.527,-7.607) 3(0.013,-7.607) 4(2.553,-7.607) 5(5.093,-7.607) 6(5.067,7.607) 7(2.527,7.607) 8(-0.013,7.607) 9(-2.553,7.607) 10(-5.093,7.607)
R0805
  rect 1.133x1.377 smd: 1(-1,0) 2(1,0)
R2010
  rect 1.282x2.7 smd: 1(-2.391,0) 2(2.391,0)
RELAY-TH_SRD-XXVDC-XL-C
  round 2.794 hole 1.524: 1(-5.1,-6) 2(7.1,-6) 3(7.1,6) 4(-5.1,6) 5(-7.1,0)
SOT-23-3_L2.9-W1.3-P1.90-LS2.4-BR
  rect 1.25x0.7 smd: 1(1,-0.95) 2(1,0.95) 3(-1,0)
SOT-23-3_L2.9-W1.6-P1.90-LS2.8-BR
  rect 1.07x0.6 smd: 1(1.235,-0.95) 2(1.235,0.95) 3(-1.235,0)
SW-TH_4P-L6.0-W6.0-P4.50-LS6.5
  round 1.8 hole 1.2: 1(-3.25,2.25) 2(3.25,2.25) 3(-3.25,-2.25) 4(3.25,-2.25)
SW-TH_16P-L21.9-W9.9-P2.54-LS7.8
  round 1.6 hole 1: 1(-8.89,-3.925) 2(-6.35,-3.925) 3(-3.81,-3.925) 4(-1.27,-3.925) 5(1.27,-3.925) 6(3.81,-3.925) 7(6.35,-3.925) 8(8.89,-3.925) 9(8.89,3.925) 10(6.35,3.925) 11(3.81,3.925) 12(1.27,3.925) 13(-1.27,3.925) 14(-3.81,3.925) 15(-6.35,3.925) 16(-8.89,3.925)
TO-92-3_L4.9-W3.7-P1.27-L
  rect 0.9x1.6 hole 0.7: 1(-1.27,0)
  oval 0.9x1.6 hole 0.7: 2(0,0) 3(1.27,0)
TO-126_L7.8-W2.7-P2.30-L
  rect 1.816x1.816 hole 1.1: 1(-2.401,0)
  round 1.816 hole 1.1: 2(-0.013,0) 3(2.401,0)
三端稳压器LM7805
  rect 2x1.5 hole 0.914: 1(-2.477,-1.079)
  oval 2x1.5 hole 0.914: 2(0.064,-1.079) 3(2.603,-1.079)
焊盘M3
  round 3.2 hole 3: 1(0.254,-0.127)
空气质量传感器
  oval 1.7x2.1 hole 1.2: 1(-2.54,0) 2(0,0) 3(2.54,0)
红外接收管封装
  round 1.7 hole 0.914: 1(0,5.08) 2(0,0)
  rect 1.7x1.7 hole 0.914: 3(0,-2.54)

## Nets
As in the schematic.

Pads without a net: IC2 29 30; RST 2 3

## Via types
v1: diameter 0.61, hole 0.305, Top Layer to Bottom Layer, 25 vias
v2: diameter 0.62, hole 0.31, Top Layer to Bottom Layer, 12 vias
v3: diameter 0.62, hole 0.305, Top Layer to Bottom Layer, 1 via

## Routing (per net, layer and track width the routed paths; a pad name or vN(x,y) marks a point on that pad's centre or on a via; arc(x,y) is an arc through that point)
+5V: length 241.9
  Top Layer w0.5: TP15.1 24.26,9.3 ; 65.97,70.29 65.97,71.31 65.97,69.71 64.71,68.44 ; IC3.3 22.48,14.91 v2(22.73,14.66) ; IC2.31 43.56,43.36 42.67,42.47 21.84,42.47 20.7,43.61 IC2.40 20.7,52.25 20.45,52.5 17.13,52.5 ; IC5.3 22.1,68.44 C11.1 ; BEEP1.1 51.81,9.3 21.34,9.3 20.69,9.96 20.69,10.72 ; 17.09,56.07 17.09,54.28 ; 57.08,70.94 57.08,68.44 ; v1(15.24,19.99) R40.2 14.33,21.66 12.94,20.27 8.74,20.27 IC4.2 ; 37.65,71.31 37.65,68.44 ; 64.71,68.44 64.9,68.63 ; 64.71,68.44 20.88,68.44 ; R1.2 13.64,27.41 13.64,20.97 ; 13.21,68.44 13.21,56.95 12.32,56.06 R36.1 11.8,54.55 12.06,54.28 18.54,54.28 19.05,53.77 19.05,52.5 ; 47.43,71.31 47.43,68.44 ; C8.1 39.26,9.31
  Bottom Layer w0.5: IC3.3 19.4,15.32 19.4,20.06 15.31,20.06 v1(15.24,19.99) ; v2(22.73,14.66) 24.26,13.13 TP15.1 ; IC2.40 19.4,43.96 19.4,19.54
+12V: length 266.6
  Top Layer w0.5: 17.14,60.17 C14.2 17.09,67.56 v3(17.14,67.61) 78.87,67.61 v2(79.38,68.12) ; VD7.1 96.55,51.33 93.6,54.28 84.81,54.28 ; VD12.2 25.56,90.19 24.38,91.36 C13.1 11.56,91.36 5.46,85.27 5.46,83.15 ; JK1.4 96.81,79.35 93.33,75.88 ; JK1.2 93.33,75.88 ; 93.33,75.88 96.81,72.41 JK2.4 96.8,57.49 93.61,54.29 93.08,54.29
  Bottom Layer w0.5: VD7.1 96.55,39.67 VD8.1 ; JK2.4 88.63,66.49 86.49,68.63 79.88,68.63 v2(79.38,68.12) ; v3(17.14,67.61) 17.14,80.82 18.42,82.09 24.29,82.09 VD12.2 ; 96.55,41.68 84.94,41.68 81.03,37.77 TP14.1 81.03,11.82 86.95,5.89
GND:
  vias: v1(75.82,66.34) v1(87.25,71.17) v1(95,71.17) v2(56.39,22.66) v2(56.51,25.83)
AIR: length 41.8
  Top Layer w0.254: LS1.2 7.87,17.45 8.89,18.47 15.49,18.47 16.76,19.74 16.76,23.66 ; 25.91,29.77 25.78,29.64 25.78,24.18 ; 15.24,28.51 15.24,23.66 ; 15.24,23.66 25.64,23.66 TP12.1 ; 15.24,23.66 15.35,23.55 ; R40.1 15.24,24.5
BEEP1_2: length 11.1
  Top Layer w0.254: VT9.3 57.4,11.35 58.67,10.08 BEEP1.2
BUZZ: length 34.8
  Top Layer w0.254: TP13.1 50.16,13.51 50.55,13.89 50.55,15.56 ; 50.55,14.58 50.55,19.37
  Bottom Layer w0.254: IC2.8 38.48,14.15 39.12,13.51 TP13.1
C7_2: length 12.1
  Top Layer w0.254: 65.88,24.44 65.14,23.69 C7.2
  Bottom Layer w0.254: IC2.18 63.88,25.07 64.52,24.44 65.88,24.44
COM1: length 21.7
  Top Layer w0.254: 36.7,73.31 36.7,78.05 DS1.3
  Bottom Layer w0.254: DS1.8 35.45,94.5 DS1.3
COM2: length 22
  Top Layer w0.254: DS2.3 48.27,78.55 46.48,76.76 46.48,73.31
  Bottom Layer w0.254: DS2.3 48.27,94.5 DS2.8
COM3: length 24.1
  Top Layer w0.254: 65.02,73.31 62.88,73.31 61.1,75.1 DS3.3
  Bottom Layer w0.254: DS3.3 61.1,94.5 DS3.8
CON2_2: length 42.7
  Bottom Layer w0.5: CON2.2 80.65,5.89 78.99,7.54 78.99,43.73 VT4.2
D0: length 83.4
  Top Layer w0.254: 68.96,57.16 LED2.2 ; v1(70.23,57.2) 69.01,57.2 68.96,57.15 68.96,53.59 68.71,53.33 68.71,52.49
  Bottom Layer w0.254: DS2.7 50.79,95.64 50.74,95.69 ; 65.22,95.69 38.86,95.69 37.96,94.79 DS1.7 ; DS3.7 64.78,95.69 68.75,95.69 70.23,94.21 v1(70.23,57.2)
D1: length 76.1
  Top Layer w0.254: DS1.6 42.07,92.95 53.33,92.95 DS2.6 ; 66.29,59.37 66.16,59.23 v1(65.02,59.23) ; 51.57,92.95 65.26,92.95 66.15,93.84 DS3.6 ; LED3.2 66.29,52.49
  Bottom Layer w0.254: DS3.6 64.91,93.28 64.91,59.35 v1(65.02,59.23)
D2: length 79
  Top Layer w0.254: v1(63.63,64.95) 69.85,64.95 70.23,64.57 70.23,62.03 69.98,61.77 64.39,61.77 63.75,61.14 63.75,59.79 63.63,59.67 63.63,52.49 ; DS3.4 62.49,80.46 55.53,80.46 54.69,79.62 54.69,78.91 53.86,78.08 52.04,78.08 DS2.4 ; LED4.2 63.75,60.26 ; v1(53.05,83.5) v1(39.96,83.5)
  Bottom Layer w0.254: DS2.4 53.05,81.55 v1(53.05,83.5) ; DS1.4 37.99,82.99 38.49,83.5 39.96,83.5 ; v1(63.63,64.95) 63.63,79.3 DS3.4
D3: length 57.3
  Top Layer w0.254: 62.19,60.76 62.16,60.72 LED5.2 ; 61.21,52.49 62.19,53.46 v1(62.19,61.75)
  Bottom Layer w0.254: 45.47,78.12 58.56,78.12 ; v1(62.19,61.75) 62.19,74.38 58.56,78.02 DS3.2 ; DS1.2 34.1,78.12 45.73,78.12 DS2.2
D4: length 75.1
  Top Layer w0.254: DS1.1 31.52,80.47 39.33,80.47 ; DS3.1 56.02,76.94 ; 56.02,76.94 v1(58.57,76.94) ; 56.02,76.94 50.22,76.94 49.53,76.25 49.53,72.69 49.16,72.33 45.83,72.33 45.34,72.82 45.34,76.25 44.7,76.89 40,76.89 39.33,77.56 39.33,80.47 ; DS2.1 42.04,80.47 39.33,80.47 ; LED6.2 v1(58.67,56.6) 58.67,52.49
  Bottom Layer w0.254: v1(58.57,76.94) 58.57,56.7 v1(58.67,56.6)
D5: length 101.5
  Top Layer w0.254: 56.13,52.49 LED7.2 ; DS1.9 34.07,95.72 41,95.72 41.83,94.88 41.83,94.16 42.6,93.39 44.57,93.39 DS2.9 46.86,95.68 57.38,95.68 DS3.9
  Top Layer w0.3: v1(41.15,59.9) 46.84,59.9 47.75,58.98 47.75,51.99 48.26,51.49 55.88,51.49 56.13,51.74 56.13,52.49
  Bottom Layer w0.254: v1(41.15,59.9) 37.82,59.9 37.08,60.63 37.08,70.16 31.79,75.45 31.79,93.44 DS1.9
D6: length 95.7
  Top Layer w0.254: 53.47,52.49 LED8.2 53.47,61.2 54.04,61.77 59.37,61.77 59.93,61.22 59.93,59.38 60.45,58.85 v1(61.34,58.85) ; DS2.10 43.17,96.19 ; v1(59.8,94.88) 59.8,95.57 59.18,96.19 31.75,96.19 30.34,94.78 DS1.10
  Bottom Layer w0.254: 59.83,90.57 59.8,94.87 ; 59.81,93.02 56.39,93.02 55.99,93.41 DS3.10 ; 59.83,90.69 59.83,77.64 62.82,74.64 62.82,59.32 62.36,58.85 v1(61.34,58.85)
D7: length 72.7
  Top Layer w0.254: DS1.5 41.63,78.21 46.67,78.21 46.99,78.54 46.99,80.06 47.39,80.47 52.2,80.47 DS2.5 55.03,80.99 64.5,80.99 DS3.5 ; 50.93,52.49 LED9.2 ; LED9.2 50.93,60.95 ; LED9.2 50.93,60.95 ; 50.93,60.95 49.95,61.94 49.95,65.24 51.05,66.34 v1(65.91,66.34)
  Bottom Layer w0.254: v1(65.91,66.34) 65.91,79.05 DS3.5
FAN: length 83.6
  Top Layer w0.254: IC2.5 32.51,31.67 46.74,31.67 47.28,31.13 47.28,28.33 47.92,27.69 83.1,27.69 84.84,25.96 96.77,25.96 97.16,25.58 VD11.2
  Bottom Layer w0.254: IC2.5 TP8.1
IC2_4: length 46.5
  Bottom Layer w0.254: 27,58.23 27,31.34 IC2.4 ; S2.1 S2.2 S2.3 S2.4 S2.5 S2.6 S2.7 S2.8
IC5_1: length 58.1
  Top Layer w0.254: C9.2 9.76,60.6
  Top Layer w0.5: C9.2 7.24,60.12 6.16,61.2 IC5.1 6.16,80.76 8.76,83.36 16.86,83.36 ; C10.1 8.06,40.11 8.06,60.12
INT0: length 56
  Top Layer w0.254: R1.1 10.17,32.56 10.05,32.56 ; IC2.12 48.64,31.17 47.24,32.56 7.24,32.56 5.84,31.17 IC4.1
  Bottom Layer w0.254: TP11.1 48.01,29.39 IC2.12
JK1: length 71.2
  Top Layer w0.254: v1(61.98,19.23) 86.46,19.23 VD9.2 89.95,19.19 91.06,18.09 TP19.1
  Bottom Layer w0.254: v1(61.98,19.23) 43.56,19.23 42.29,20.5 42.29,30.42 41.03,31.68 36.59,31.68 35.94,31.04 IC2.7
JK2: length 68.2
  Top Layer w0.254: 50.09,20.37 84.83,20.37 84.97,20.5 90.51,20.5 VD10.2 ; 50.08,20.37 v1(36.7,20.37)
  Bottom Layer w0.254: v1(36.7,20.37) TP7.1 34.16,23.8 33.4,24.56 IC2.6
JK2_1: length 42.3
  Top Layer w0.254: 84.81,66.49 84.81,63.9 84.24,63.33 VT3.3 ; 81.04,63.33 82.04,63.33 82.04,47.3 82.55,46.79 89.53,46.79 89.92,46.41 89.92,40.94 88.52,39.55 87.98,39.55
LED10_1: length 12.1
  Top Layer w0.254: 9.79,56.06 9.79,49.69 10.92,48.56 LED10.1
LED12_1: length 26.8
  Top Layer w0.254: 72.77,72.02 74.26,72.02 75.06,72.82 v2(75.06,93.14)
  Bottom Layer w0.254: v2(75.06,93.14) 75.06,93.78 75.47,94.19 VD14.1
LS1_1: length 21.8
  Top Layer w0.5: LS1.1 3.3,13.51 3.3,24.18 4.17,25.05 R39.1
LS3_1: length 109.5
  Top Layer w0.254: v2(74.04,77.39) 72.77,77.39 ; v2(71.63,68.89) 71.63,72.98 72.77,74.13 72.77,78.93
  Bottom Layer w0.254: v2(74.04,77.39) 74.68,78.03 74.68,89.08 75.68,90.08 JK1.5 ; v2(71.63,68.89) 72.64,68.89 73.15,68.38 73.15,44.37 73.53,43.99 77.09,43.99 77.85,43.23 77.85,8.35 LS3.1
LS3_2: length 119.2
  Top Layer w0.254: 78.1,78.81 78.1,74.13 79.76,74.13 v2(79.88,74.25) ; LS3.2 70.4,11.52 71.37,12.5 v2(88.39,12.5) ; v2(91.82,40.06) 91.77,40.1 91.77,47.09 90.93,47.93 83.95,47.93 82.55,49.33 82.55,61.23 83.86,62.53 89.79,62.53 90.81,63.55 JK2.5
  Bottom Layer w0.254: v2(91.82,40.06) 91.82,36.88 89.03,34.09 89.03,12.88 88.65,12.5 v2(88.39,12.5) ; v2(79.88,74.25) 79.88,72.44 80.39,71.93 90.55,71.93 90.81,71.68 JK2.5
P00: length 5.3
  Top Layer w0.254: 22.99,50.48 22.99,49.64 23.24,49.39 IC2.39
P01: length 5.3
  Top Layer w0.254: 25.53,50.48 25.53,45.52 IC2.38
P1.0: length 32.5
  Bottom Layer w0.254: IC2.1 20.7,3.99 22.86,1.83 J5.1
P1.1: length 30.5
  Bottom Layer w0.254: J5.2 28.83,24.44 IC2.2
P02: length 5.3
  Top Layer w0.254: IC2.37 28.07,45.52 28.07,50.48
P2.0: length 5.3
  Top Layer w0.254: 68.71,50.48 68.71,45.52 IC2.21
P2.1: length 5.3
  Top Layer w0.254: IC2.22 66.29,45.39 66.29,50.48
P2.2: length 5.3
  Top Layer w0.254: 63.63,50.48 63.63,45.52 IC2.23
P2.3: length 5.3
  Top Layer w0.254: 61.21,50.48 61.21,45.39 IC2.24
P2.4: length 5.3
  Top Layer w0.254: IC2.25 58.67,45.39 58.67,50.48
P2.5: length 5.3
  Top Layer w0.254: 56.13,50.48 56.13,45.39 IC2.26
P2.6: length 5.3
  Top Layer w0.254: 53.47,50.48 53.47,45.52 IC2.27
P2.7: length 5.3
  Top Layer w0.254: IC2.28 51.18,49.39 50.93,49.64 50.93,50.48
P03: length 5.3
  Top Layer w0.254: 30.61,50.48 30.61,45.52 IC2.36
P3.4: length 61.7
  Top Layer w0.254: v1(34.54,71.17) R27.1
  Bottom Layer w0.254: IC2.14 53.72,30.78 52.83,31.67 47.75,31.67 47.37,32.06 47.37,58.09 46.15,59.31 35.48,59.31 34.54,60.25 v1(34.54,71.17)
P3.5: length 53.5
  Top Layer w0.254: R28.1 v1(43.78,71.18)
  Bottom Layer w0.254: v1(43.78,71.18) 51.68,71.18 52.45,70.41 52.45,33.83 IC2.15
P3.6: length 51.5
  Top Layer w0.254: R29.1 60.96,71.93 60.71,72.19 v1(59.82,72.19)
  Bottom Layer w0.254: IC2.16 58.8,29.26 59.69,28.37 61.98,28.37 62.61,29.01 62.61,55.17 59.82,57.96 v1(59.82,72.19)
P3.7: length 49.2
  Top Layer w0.254: v1(53.21,71.17) R30.1
  Bottom Layer w0.254: IC2.17 60.71,30.02 57.53,33.2 57.53,70.54 56.9,71.17 v1(53.21,71.17)
P04: length 5.3
  Top Layer w0.254: 33.27,50.48 33.27,45.39 IC2.35
P05: length 5.3
  Top Layer w0.254: IC2.34 35.81,45.39 35.81,50.48
P06: length 5.3
  Top Layer w0.254: IC2.33 38.35,45.39 38.35,50.48
P07: length 5.3
  Top Layer w0.254: IC2.32 41.02,49.51 40.89,49.64 40.89,50.48
R10_2: length 14.5
  Top Layer w0.254: S2.16 21.97,64.94 21.97,54.35 22.99,53.33 22.99,52.49
R11_2: length 14.5
  Top Layer w0.254: S2.15 24.53,64.95 24.53,54.33 25.53,53.33 25.53,52.49
R12_2: length 14.5
  Top Layer w0.254: 28.07,52.49 28.07,53.33 27.07,54.33 27.07,64.95 S2.14
R13_2: length 14.5
  Top Layer w0.254: 30.61,52.49 30.61,53.33 29.61,54.33 29.61,64.95 S2.13
R14_2: length 14.5
  Top Layer w0.254: S2.12 32.16,64.97 32.16,54.44 33.27,53.33 33.27,52.49
R15_2: length 14.5
  Top Layer w0.254: 35.81,52.49 35.81,53.33 34.7,54.44 34.7,64.97 S2.11
R16_2: length 14.5
  Top Layer w0.254: 38.35,52.49 38.35,53.33 37.24,54.44 37.24,64.97 S2.10
R17_2: length 14.5
  Top Layer w0.254: 40.89,52.49 40.89,53.33 39.78,54.44 39.78,64.97 S2.9
R18_2: length 43.6
  Top Layer w0.254: 41.76,11.81 33.9,11.81 RST.4 ; 39.75,17.47 40.75,17.47 41.76,16.45 41.76,10.72
  Bottom Layer w0.254: IC2.9 39.81,31.23 38.02,31.23 37.28,30.5 37.28,29.33 37.78,28.83 37.78,13.96 41.02,10.72 41.76,10.72
R29_2: length 4.3
  Top Layer w0.254: 64.07,71.31 64.07,71.73 63.59,72.22 61.7,72.22 60.96,72.96 R29.2
R30_2: length 7
  Top Layer w0.254: 55.18,71.75 55.18,70.94 55.18,72.88 54.89,73.18 R30.2
R33_2: length 28
  Top Layer w0.254: R33.2 97.16,36.63 96.65,37.14 80.9,37.14 79.25,38.79 79.25,45.66 VT4.3
R37_2: length 4.7
  Top Layer w0.254: VD13.2 72.77,80.94
RXD: length 56.5
  Top Layer w0.254: J4.2 12.57,16.94 13.46,17.83 32.38,17.83 33.5,18.95 33.5,25.84 35.27,27.6 43.05,27.6 43.56,28.12 IC2.10
TEMP: length 53.2
  Top Layer w0.254: TP9.1 52.45,26.09 48.26,21.9 36.83,21.9 35.31,20.37 35.31,14.02 33.95,12.67 18.54,12.67 ; IC3.2 18.54,10.72 R34.2
  Bottom Layer w0.254: TP9.1 53.34,27.86 IC2.13
TP10_1: length 24.4
  Top Layer w0.254: 70.77,24.44 71.64,23.56 75.18,23.56
  Bottom Layer w0.254: IC2.19 70.77,25.68 70.77,17.22 69.98,16.43 TP10.1 66.8,15.72
TXD: length 61
  Top Layer w0.254: 18.15,16.78 18.56,17.2 33.91,17.2 34.38,17.67 34.38,25.16 35.49,26.27 45.4,26.27 46.1,26.97 IC2.11
  Bottom Layer w0.254: J4.1 10.03,5.6 11.13,6.7 15.28,6.7 15.88,7.29 15.88,15.8 16.86,16.78 18.16,16.78
  vias: v1(18.15,16.78)
VD7_2: length 61.2
  Top Layer w0.254: VD7.2 82.31,45.01 81.03,46.3 81.03,62.41 v2(80.9,62.53) 80.39,62.03 73.66,62.03 73.03,62.66 VT2.3
  Top Layer w0.3: JK1.1 82.7,88.08 80.9,86.28 v2(80.9,64.69)
  Bottom Layer w0.3: v2(80.9,64.69) v2(80.9,62.53)
VD9_1: length 4.6
  Top Layer w0.254: R31.1 VD9.1
VD10_1: length 4.6
  Top Layer w0.254: R32.1 VD10.1
VD11_1: length 4.6
  Top Layer w0.254: R33.1 VD11.1
VD13_1: length 26.8
  Top Layer w0.254: 72.77,94.32 75.56,94.32 75.82,94.06 75.82,73.17 76.96,72.02 78.1,72.02
VD14_2: length 4.7
  Top Layer w0.254: 78.1,85.49 R38.1
VT2_1: length 50.4
  Top Layer w0.3: VT2.1 73.97,66.28 73.41,66.85 71.5,66.85 70.99,66.34 70.99,35.74 72.28,34.45 R31.2
VT3_1: length 56.2
  Top Layer w0.254: R32.2 91.82,35.61 90.93,36.5 73.53,36.5 72.39,37.64 72.39,64.11 72.98,64.7 79.27,64.7 79.56,64.99 VT3.1
VT5_1: length 6.3
  Top Layer w0.254: 35.75,71.31 35.75,72.76 35.33,73.18 R27.2
VT6_1: length 5.4
  Top Layer w0.254: 45.53,71.31 45.53,71.87 44.22,73.18 R28.2
VT8_3: length 31.7
  Top Layer w0.254: LED6.1 LED5.1 LED4.1 LED3.1 LED2.1 ; LED6.1 LED7.1 LED8.1 LED9.1 ; LED6.1 58.67,65.2 v1(59.18,65.71) ; 59.16,72.59 59.16,73.1 58.85,73.4 VT8.3
  Bottom Layer w0.254: v1(59.16,72.59) 59.18,72.57 v1(59.18,65.71)
VT9_1: length 10.8
  Top Layer w0.3: R35.2 50.55,22.78 51.05,23.29 57.78,23.29 58.35,22.72 VT9.1

## Copper pours and planes (outline as drawn; the poured copper is in the pictures)
GND on Top Layer: 0,100 99.95,100 99.95,0.05 0.13,0.05
GND on Bottom Layer: 0,100 99.95,100 99.95,0.05 0.13,0.05

Small or netless copper shapes (teardrops, artwork), in the pictures only: 271 on Top Layer, 111 on Bottom Layer

## Text on the board
Top Silkscreen Layer: 空调控制板
